# Altium schematic sheet DSP_Block.SchDoc
size A4; SheetNumber: 13; SheetTotal: 13
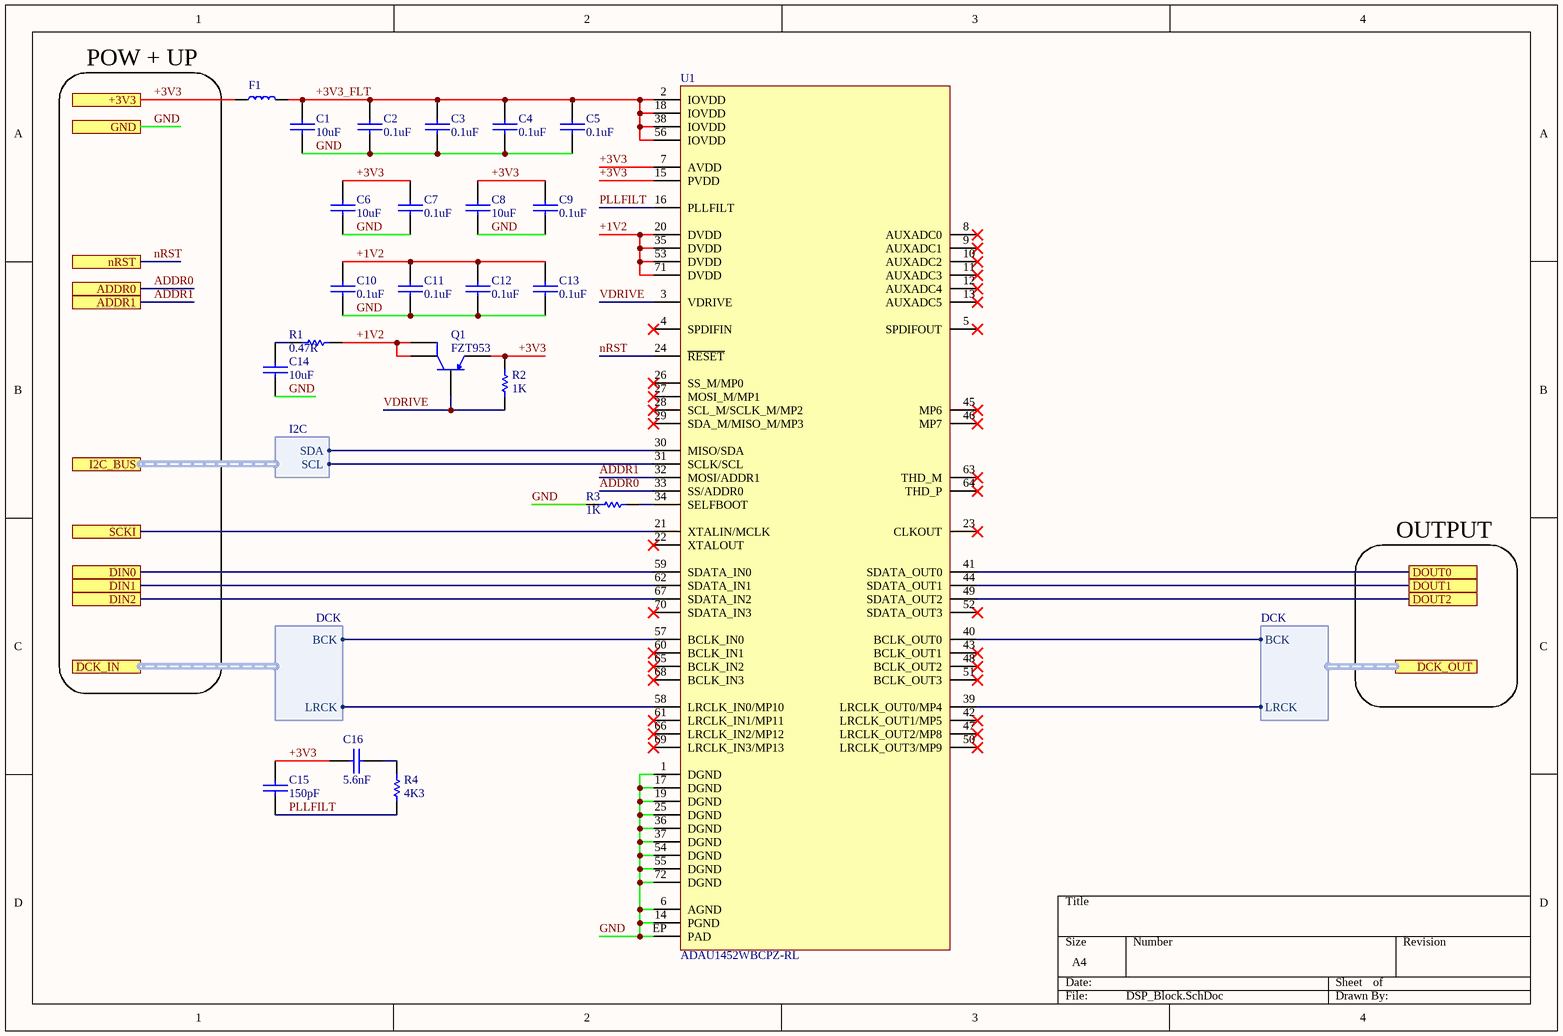
[diagram p0: DSP_Block.SchDoc]

## Parts
C1  10uF  [0603-CAP-TDK]
C2  0.1uF  [0402-CAP-TDK]
C3  0.1uF  [0402-CAP-TDK]
C4  0.1uF  [0402-CAP-TDK]
C5  0.1uF  [0402-CAP-TDK]
C6  10uF  [0603-CAP-TDK]
C7  0.1uF  [0402-CAP-TDK]
C8  10uF  [0603-CAP-TDK]
C9  0.1uF  [0402-CAP-TDK]
C10  0.1uF  [0402-CAP-TDK]
C11  0.1uF  [0402-CAP-TDK]
C12  0.1uF  [0402-CAP-TDK]
C13  0.1uF  [0402-CAP-TDK]
C14  10uF  [0603-CAP-TDK]
C15  150pF  [0402-CAP-TDK]
C16  5.6nF  [0402-CAP-TDK]
F1  YI201209U301-2R0T  [0805-IND]  (value not drawn)
Q1  FZT953  [SOT223-DN]
R1  0.47R  [0805-RES-PANASONIC]
R2  1K  [0402-RES-PANASONIC]
R3  1K  [0402-RES-PANASONIC]
R4  4K3  [0402-RES-PANASONIC]
U1  ADAU1452WBCPZ-RL  [LFCSP-VQ-72]

## Ports
+3V3 (see AudioDSP-v3.0_top[5B], ADC_Block[1A], ADC_Interface[1B], CTRL_Connectors[1A], DAC_Block[1B], MCU_Block[1A], PLL_Block[1A], POW_Block[4B]), ADDR0 (see AudioDSP-v3.0_top[5B]), ADDR1 (see AudioDSP-v3.0_top[5B]), DCK_IN (harness DCK, see AudioDSP-v3.0_top[5B]), DCK_OUT (harness DCK, see AudioDSP-v3.0_top[5B]), DIN0 (see AudioDSP-v3.0_top[5B]), DIN1 (see AudioDSP-v3.0_top[5B]), DIN2 (see AudioDSP-v3.0_top[5B]), DOUT0 (see AudioDSP-v3.0_top[5B]), DOUT1 (see AudioDSP-v3.0_top[5B]), DOUT2 (see AudioDSP-v3.0_top[5B]), GND (see AudioDSP-v3.0_top[5B], ADC_Block[1B], ADC_Interface[1B], CTRL_Connectors[1A], DAC_Block[1B], IN_Connectors[3A], LPF_Block[1B], LPF_Interface[1B], MCU_Block[1B], OUT_Connectors[3B], PLL_Block[1A], POW_Block[1B]), I2C_BUS (harness I2C, see AudioDSP-v3.0_top[5B], ADC_Block[1B]), nRST (see AudioDSP-v3.0_top[5B]), SCKI (see AudioDSP-v3.0_top[5B])

## Harnesses
I2C: SCL, SDA
DCK: BCK, LRCK

## Nets
+1V2: C10.2 C11.2 C12.2 C13.2 Q1.C Q1.C-TAB R1.1 U1.20(DVDD) U1.35(DVDD) U1.53(DVDD) U1.71(DVDD)
+3V3: C6.2 C7.2 C8.2 C9.2 C15.2 C16.2 F1.2 Q1.E R2.2 U1.7(AVDD) U1.15(PVDD) ; port +3V3
+3V3_FLT: C1.2 C2.2 C3.2 C4.2 C5.2 F1.1 U1.2(IOVDD) U1.18(IOVDD) U1.38(IOVDD) U1.56(IOVDD)
ADDR0: U1.33(SS/ADDR0) ; port ADDR0
ADDR1: U1.32(MOSI/ADDR1) ; port ADDR1
DIN0: U1.59(SDATA_IN0) ; port DIN0
DIN1: U1.62(SDATA_IN1) ; port DIN1
DIN2: U1.67(SDATA_IN2) ; port DIN2
DOUT0: U1.41(SDATA_OUT0) ; port DOUT0
DOUT1: U1.44(SDATA_OUT1) ; port DOUT1
DOUT2: U1.49(SDATA_OUT2) ; port DOUT2
GND: C1.1 C2.1 C3.1 C4.1 C5.1 C6.1 C7.1 C8.1 C9.1 C10.1 C11.1 C12.1 C13.1 C14.1 R3.2 U1.1(DGND) U1.6(AGND) U1.14(PGND) U1.17(DGND) U1.19(DGND) U1.25(DGND) U1.36(DGND) U1.37(DGND) U1.54(DGND) U1.55(DGND) U1.72(DGND) U1.EP(PAD) ; port GND
nRST: U1.24(~{RESET}) ; port nRST
PLLFILT: C15.1 R4.1 U1.16(PLLFILT)
SCKI: U1.21(XTALIN/MCLK) ; port SCKI
VDRIVE: Q1.B R2.1 U1.3(VDRIVE)
NetC14_2: C14.2 R1.2
NetC16_1: C16.1 R4.2
NetR3_1: R3.1 U1.34(SELFBOOT)
NetU1_30: U1.30(MISO/SDA) ; port I2C_BUS.SDA
NetU1_31: U1.31(SCLK/SCL) ; port I2C_BUS.SCL
NetU1_39: U1.39(LRCLK_OUT0/MP4) ; port DCK_OUT.LRCK
NetU1_40: U1.40(BCLK_OUT0) ; port DCK_OUT.BCK
NetU1_57: U1.57(BCLK_IN0) ; port DCK_IN.BCK
NetU1_58: U1.58(LRCLK_IN0/MP10) ; port DCK_IN.LRCK

Not connected (* = marked no-connect by the designer): U1 4(SPDIFIN)* 5(SPDIFOUT)* 8(AUXADC0)* 9(AUXADC1)* 10(AUXADC2)* 11(AUXADC3)* 12(AUXADC4)* 13(AUXADC5)* 22(XTALOUT)* 23(CLKOUT)* 26(SS_M/MP0)* 27(MOSI_M/MP1)* 28(SCL_M/SCLK_M/MP2)* 29(SDA_M/MISO_M/MP3)* 42(LRCLK_OUT1/MP5)* 43(BCLK_OUT1)* 45(MP6)* 46(MP7)* 47(LRCLK_OUT2/MP8)* 48(BCLK_OUT2)* 50(LRCLK_OUT3/MP9)* 51(BCLK_OUT3)* 52(SDATA_OUT3)* 60(BCLK_IN1)* 61(LRCLK_IN1/MP11)* 63(THD_M)* 64(THD_P)* 65(BCLK_IN2)* 66(LRCLK_IN2/MP12)* 68(BCLK_IN3)* 69(LRCLK_IN3/MP13)* 70(SDATA_IN3)*

## Notes on the sheet
- POW + UP
- OUTPUT

## Library data of the parts
C1-C16 = CAP-SMD
  C1 C6 C8 C14: JLCPart: C96446
  C2-C5 C7 C9-C13: JLCPart: C307331
  C15: JLCPart: C363511
  C16: JLCPart: C527017
F1 = YI201209U301-2R0T: 100mΩ ±25% 300Ω@100MHz 0805; JLCPart: C2858467
R1-R4 = RES-SMD
  R1: JLCPart: C308364
  R2 R3: JLCPart: C11702
  R4: JLCPart: C517692
U1 = ADAU1452WBCPZ-RL: SigmaDSP 294.912 MHz, 32-bit Audio Processor; JLCPart: C462188